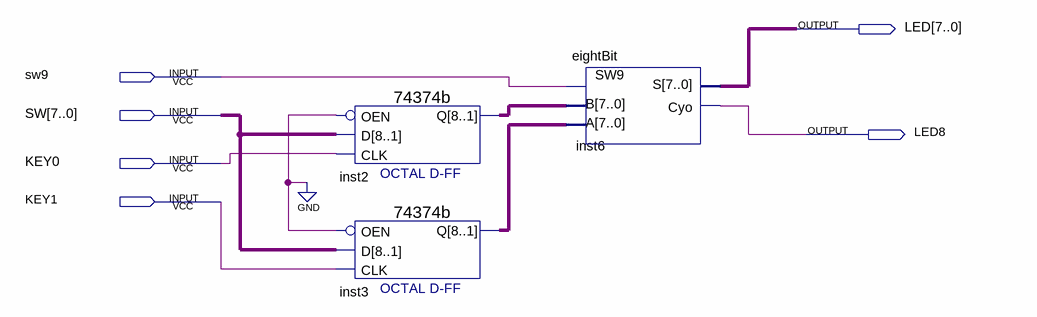
[diagram p0: schematic sheet]
// Quartus schematic final.bdf as structural Verilog: 3 symbols, 6 pins
module \final  (
  input  sw9,
  input  [7:0] SW,
  input  KEY0,
  input  KEY1,
  output [7:0] LED,
  output LED8
);

  wire [7:0] inst2_q, inst3_q;

  \74374b  inst2 (.D(SW), .OEN(1'b0), .CLK(KEY0), .Q(inst2_q));
  \74374b  inst3 (.D(SW), .OEN(1'b0), .CLK(KEY1), .Q(inst3_q));
  eightBit inst6 (.B(inst2_q), .SW9(sw9), .A(inst3_q), .S(LED), .Cyo(LED8));
endmodule
